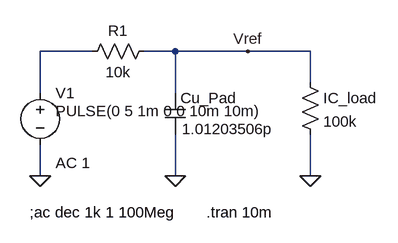
[diagram p0: schematic Lab 2 Experiment 3.asc]
Lab 2 Experiment 3.asc, the LTspice schematic file:
Version 4
SHEET 1 880 680
WIRE 144 64 64 64
WIRE 272 64 224 64
WIRE 384 64 272 64
WIRE 480 64 384 64
WIRE 480 112 480 64
WIRE 64 128 64 64
WIRE 272 128 272 64
WIRE 64 256 64 208
WIRE 272 256 272 192
WIRE 480 256 480 192
FLAG 272 256 0
FLAG 64 256 0
FLAG 384 64 Vref
FLAG 480 256 0
SYMBOL voltage 64 112 R0
WINDOW 123 24 124 Left 2
WINDOW 39 0 0 Left 0
WINDOW 3 24 44 Left 2
SYMATTR Value2 AC 1
SYMATTR InstName V1
SYMATTR Value PULSE(0 5 1m 0 0 10m 10m)
SYMBOL res 240 48 R90
WINDOW 0 0 56 VBottom 2
WINDOW 3 32 56 VTop 2
SYMATTR InstName R1
SYMATTR Value 10k
SYMBOL cap 256 128 R0
WINDOW 3 26 56 Left 2
SYMATTR Value 1.01203506p
SYMATTR InstName Cu_Pad
SYMBOL res 464 96 R0
SYMATTR InstName IC_load
SYMATTR Value 100k
TEXT 48 312 Left 2 !;ac dec 1k 1 100Meg
TEXT 320 312 Left 2 !.tran 10m

The netlist it stands for:
* Lab 2 Experiment 3.asc
V1 N001 0 PULSE(0 5 1m 0 0 10m 10m) AC 1
R1 Vref N001 10k
Cu_Pad Vref 0 1.01203506p
R§IC_load Vref 0 100k
;ac dec 1k 1 100Meg
.tran 10m
.backanno
.end